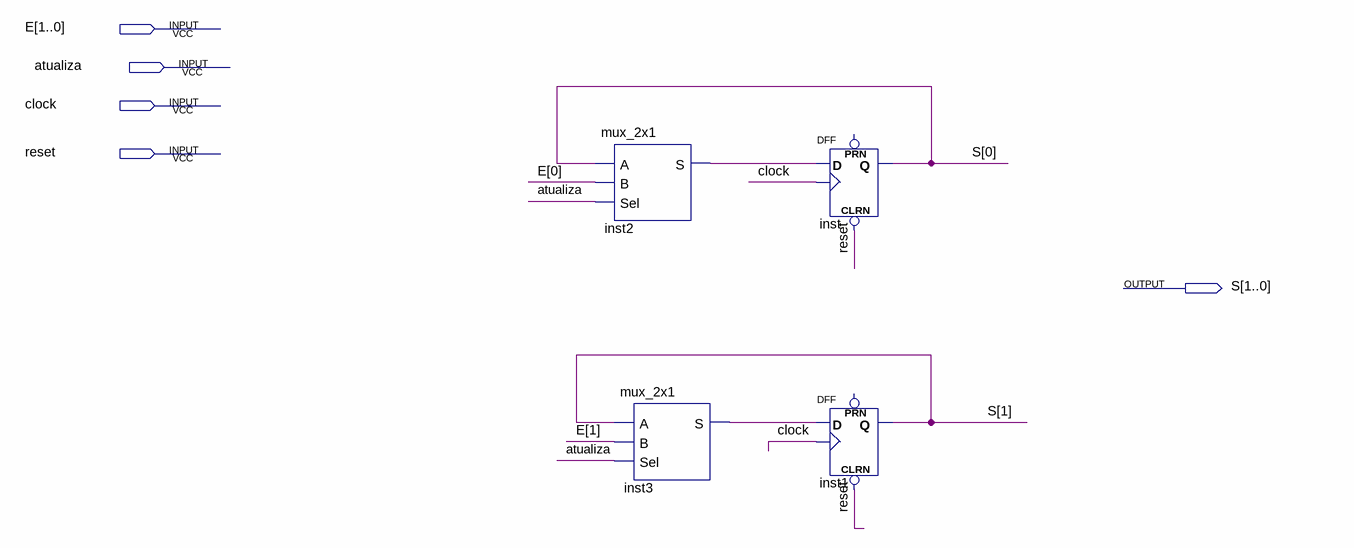
[diagram p0: schematic sheet]
// Quartus schematic registrador_2bits.bdf as structural Verilog: 4 symbols, 5 pins
module registrador_2bits (
  input  [1:0] E,
  input  atualiza,
  input  clock,
  input  reset,
  output [1:0] S
);

  wire inst2_s, inst3_s;

  mux_2x1 inst2 (.A(S[0]), .B(E[0]), .Sel(atualiza), .S(inst2_s));
  mux_2x1 inst3 (.A(S[1]), .B(E[1]), .Sel(atualiza), .S(inst3_s));
  DFF inst (.CLRN(reset), .CLK(clock), .D(inst2_s), .Q(S[0]));  // open: PRN
  DFF inst1 (.CLRN(reset), .CLK(clock), .D(inst3_s), .Q(S[1]));  // open: PRN
endmodule
